# Altium schematic sheet ESP32_C5.SchDoc
size A4; SheetNumber: 2; SheetTotal: 7
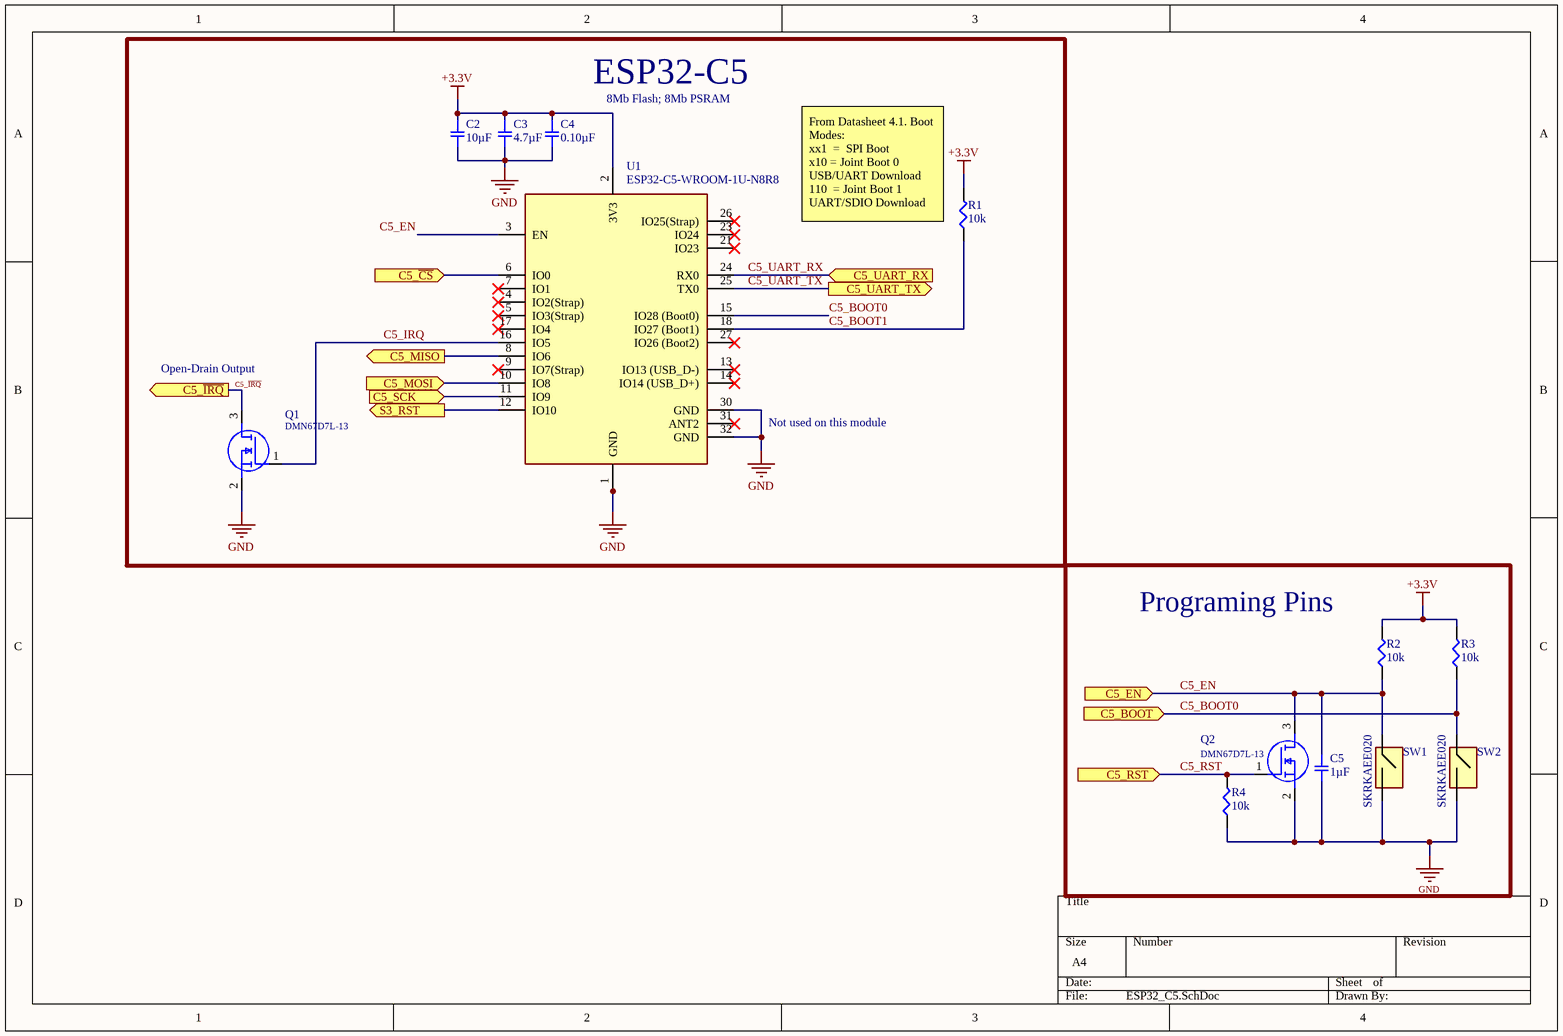
[diagram p0: ESP32_C5.SchDoc]

## Parts
C2  10µF  [SMD-0603C]
C3  4.7µF  [SMD-0402C]
C4  0.10µF  [SMD-0402C]
C5  1µF  [SMD-0402C]
Q1  DMN67D7L-13  [DMN67D7L13]
Q2  DMN67D7L-13  [DMN67D7L13]
R1  10k  [SMD-0402-RES]
R2  10k  [SMD-0402-RES]
R3  10k  [SMD-0402-RES]
R4  10k  [SMD-0402-RES]
SW1  SKRKAEE020  [SKRKAEE020]
SW2  SKRKAEE020  [SKRKAEE020]
U1  ESP32-C5-WROOM-1U-N8R8  [ESP32C5WROOM1UN8R8]

## Blocks framed on the sheet
ESP32-C5: C2-C4 Q1 R1 U1
Programing Pins: C5 Q2 R2-R4 SW1 SW2

## Ports
C5_BOOT (in), C5_EN (in), C5_MISO (out), C5_MOSI (in), C5_RST (in), C5_SCK (in), C5_UART_RX (in), C5_UART_TX (out), C5_~{CS} (in), C5_~{IRQ} (out), S3_RST (out)

## Nets
+3.3V: C2.1 C3.1 C4.1 R1.2 R2.2 R3.2 U1.2(3V3)
GND: C2.2 C3.2 C4.2 C5.2 Q1.2(S) Q2.2(S) R4.1 SW1.2 SW2.2 U1.1(GND) U1.28(GND) U1.29(GND) U1.30(GND) U1.32(GND)
C5_BOOT0: R3.1 SW2.1 U1.15(IO28_(Boot0)) ; port C5_BOOT
C5_BOOT1: R1.1 U1.18(IO27_(Boot1))
C5_~{CS}: U1.6(IO0) ; port C5_~{CS}
C5_EN: C5.1 Q2.3(D) R2.1 SW1.1 U1.3(EN) ; port C5_EN
C5_~{IRQ}: Q1.3(D) ; port C5_~{IRQ}
C5_IRQ: Q1.1(G) U1.16(IO5)
C5_MISO: U1.8(IO6) ; port C5_MISO
C5_MOSI: U1.10(IO8) ; port C5_MOSI
C5_RST: Q2.1(G) R4.2 ; port C5_RST
C5_SCK: U1.11(IO9) ; port C5_SCK
C5_UART_RX: U1.24(RX0) ; port C5_UART_RX
C5_UART_TX: U1.25(TX0) ; port C5_UART_TX
S3_RST: U1.12(IO10) ; port S3_RST

Not connected (* = marked no-connect by the designer): U1 4(IO2(Strap))* 5(IO3(Strap))* 7(IO1)* 9(IO7(Strap))* 13(IO13_(USB_D-))* 14(IO14_(USB_D+))* 17(IO4)* 19(NC/IO15) 20(NC_1) 21(IO23)* 22(NC_2) 23(IO24)* 26(IO25(Strap))* 27(IO26_(Boot2))* 31(ANT2)*

## Notes on the sheet
- 8Mb Flash; 8Mb PSRAM
- (near R1) From Datasheet 4.1. Boot Modes:
  xx1  =  SPI Boot
  x10 = Joint Boot 0 USB/UART Download
  110  = Joint Boot 1 UART/SDIO Download
- (near Q1) Open-Drain Output
- Not used on this module

## Library data of the parts
C2 = GRM185R60J106ME15D: CAP CER 10UF 6.3V X5R 0603; Manufacturer: Murata Electronics North America; Factory Stock: 0; Unit Price (USD): 0.36; Minimum Quantity: 1; Tolerance: ±20%; Datasheets: http://www.murata.com/~/media/webrenewal/support/library/catalog/products/capacitor/mlcc/c02e.pdf; Image: //media.digikey.com/Renders/Murata%20Renders/ZRB-SERIES-0402.jpg; Digi-Key Part Number: 490-10467-1-ND; Part Number: GRM185R60J106ME15D; Quantity Available: 25068; @ qty: 0; Packaging: Cut Tape (CT); Series: GRM; Part Status: Active; Value: 10µF; Voltage: 6.3V; Temperature Coefficient: X5R; Operating Temperature: -55°C ~ 85°C; Features: Derating Recommended; Ratings: -; Applications: General Purpose; Mounting Type: Surface Mount, MLCC; Package / Case: 0603 (1608 Metric); Size / Dimension: 0.063" L x 0.031" W (1.60mm x 0.80mm); Height - Seated (Max): -; Thickness (Max): 0.022" (0.55mm); Lead Spacing: -; Lead Style: -
C3 = GRM153R60J475ME15D: CAP CER 4.7UF 6.3V X5R 0402; Manufacturer: Murata Electronics North America; Factory Stock: 0; Unit Price (USD): 0.27; Minimum Quantity: 1; Tolerance: ±20%; Datasheets: http://psearch.en.murata.com/capacitor/product/GRM153R60J475ME15%23.pdf; Image: //media.digikey.com/Renders/Murata%20Renders/ZRB-SERIES-0402.jpg; Digi-Key Part Number: 490-13232-1-ND; Part Number: GRM153R60J475ME15D; Quantity Available: 30412; @ qty: 0; Packaging: Cut Tape (CT); Series: GRM; Part Status: Active; Value: 4.7µF; Voltage: 6.3V; Temperature Coefficient: X5R; Operating Temperature: -55°C ~ 85°C; Features: Derating Recommended; Ratings: -; Applications: General Purpose; Mounting Type: Surface Mount, MLCC; Package / Case: 0402 (1005 Metric); Size / Dimension: 0.039" L x 0.020" W (1.00mm x 0.50mm); Height - Seated (Max): -; Thickness (Max): 0.013" (0.33mm); Lead Spacing: -; Lead Style: -
C4 = GCM155R71C104KA55D: CAP CER 0.1UF 16V X7R 0402; Manufacturer: Murata Electronics North America; Factory Stock: 0; Unit Price (USD): 0.1; Minimum Quantity: 1; Tolerance: ±10%; Datasheets: http://www.murata.com/~/media/webrenewal/support/library/catalog/products/capacitor/mlcc/c03e.ashx; Image: //media.digikey.com/Renders/Murata%20Renders/ZRB-SERIES-0402.jpg; Digi-Key Part Number: 490-4759-1-ND; Part Number: GCM155R71C104KA55D; Quantity Available: 734194; @ qty: 0; Packaging: Cut Tape (CT); Series: GCM; Part Status: Active; Value: 0.10µF; Voltage: 16V; Temperature Coefficient: X7R; Operating Temperature: -55°C ~ 125°C; Features: -; Ratings: AEC-Q200; Applications: Automotive; Mounting Type: Surface Mount, MLCC; Package / Case: 0402 (1005 Metric); Size / Dimension: 0.039" L x 0.020" W (1.00mm x 0.50mm); Height - Seated (Max): -; Thickness (Max): 0.022" (0.55mm); Lead Spacing: -; Lead Style: -
C5 = GCM155C71A105KE38D: CAP CER 1UF 10V X7S 0402; Manufacturer: Murata Electronics North America; Factory Stock: 0; Unit Price (USD): 0.12; Minimum Quantity: 1; Tolerance: ±10%; Datasheets: http://www.murata.com/~/media/webrenewal/support/library/catalog/products/capacitor/mlcc/c03e.ashx; Image: //media.digikey.com/Renders/Murata%20Renders/ZRB-SERIES-0402.jpg; Digi-Key Part Number: 490-13409-1-ND; Part Number: GCM155C71A105KE38D; Quantity Available: 7240; @ qty: 0; Packaging: Cut Tape (CT); Series: GCM; Part Status: Active; Value: 1µF; Voltage: 10V; Temperature Coefficient: X7S; Operating Temperature: -55°C ~ 125°C; Features: -; Ratings: AEC-Q200; Applications: Automotive; Mounting Type: Surface Mount, MLCC; Package / Case: 0402 (1005 Metric); Size / Dimension: 0.039" L x 0.020" W (1.00mm x 0.50mm); Height - Seated (Max): -; Thickness (Max): 0.022" (0.55mm); Lead Spacing: -; Lead Style: -
Q1 Q2 = DMN67D7L-13: MOSFET (N-Channel); Manufacturer_Name: Diodes Incorporated; Datasheet Link: https://www.diodes.com/assets/Package-Files/SOT23.pdf; Height: 1.1mm; Manufacturer_Part_Number: DMN67D7L-13; Mouser Part Number: 621-DMN67D7L-13; Mouser Price/Stock: https://www.mouser.co.uk/ProductDetail/Diodes-Incorporated/DMN67D7L-13?qs=W0yvOO0ixfHR5TrLcSFuNw%3D%3D; Arrow Part Number: DMN67D7L-13; Arrow Price/Stock: https://www.arrow.com/en/products/dmn67d7l-13/diodes-incorporated?region=nac; Value: DMN67D7L-13
R1-R4 = ERJ-2RKF1002X: RES SMD 10K OHM 1% 1/10W 0402; Manufacturer: Panasonic Electronic Components; Factory Stock: 0; Unit Price (USD): 0.00496; @ qty: 1500; Minimum Quantity: 1; Power (Watts): 0.1W, 1/10W; Temperature Coefficient: ±100ppm/°C; Part Number: ERJ-2RKF1002X; Datasheets: http://industrial.panasonic.com/www-cgi/jvcr13pz.cgi?E+PZ+3+AOA0002+ERJ2RKF1002X+7+WW; Image: //media.digikey.com/Photos/Panasonic%20Photos/ERJ-PA2-Series.jpg; Digi-Key Part Number: P10.0KLCT-ND; Quantity Available: 9922786; Packaging: Cut Tape (CT); Series: ERJ; Part Status: Active; Value: 10k; Tolerance: ±1%; Composition: Thick Film; Features: Automotive AEC-Q200; Operating Temperature: -55°C ~ 155°C; Package / Case: 0402 (1005 Metric); Supplier Device Package: 0402; Size / Dimension: 0.039" L x 0.020" W (1.00mm x 0.50mm); Height - Seated (Max): 0.016" (0.40mm); Number of Terminations: 2; Failure Rate: -
SW1 SW2 = SKRKAEE020: Tactile Switches 3.9x2.9x2.0mm 160gf Packaging Temp 80oC; Manufacturer_Name: ALPS Electric; Datasheet Link: http://www.alps.com/prod/info/J/HTML/Tact/SurfaceMount/SKRK/SKRKAEE020.html; Height: 2mm; Manufacturer_Part_Number: SKRKAEE020; Mouser Part Number: 688-SKRKAEE020; Mouser Price/Stock: https://www.mouser.co.uk/ProductDetail/Alps-Alpine/SKRKAEE020?qs=MrosSN5%252BUQW89XjXIp8Ugw%3D%3D; Value: SKRKAEE020
U1 = ESP32-C5-WROOM-1U-N8R8: Integrated Circuit; Manufacturer_Name: Espressif Systems; Manufacturer_Part_Number: ESP32-C5-WROOM-1-N8R8; Datasheet Link: https://documentation.espressif.com/esp32-c5-wroom-1_wroom-1u_datasheet_en.pdf; Height: 3.45mm; Value: ESP32-C5-WROOM-1U-N8R8